# Altium schematic sheet AWSAM_5_MPU_3V.SchDoc
size A4; Engineer: Akshat
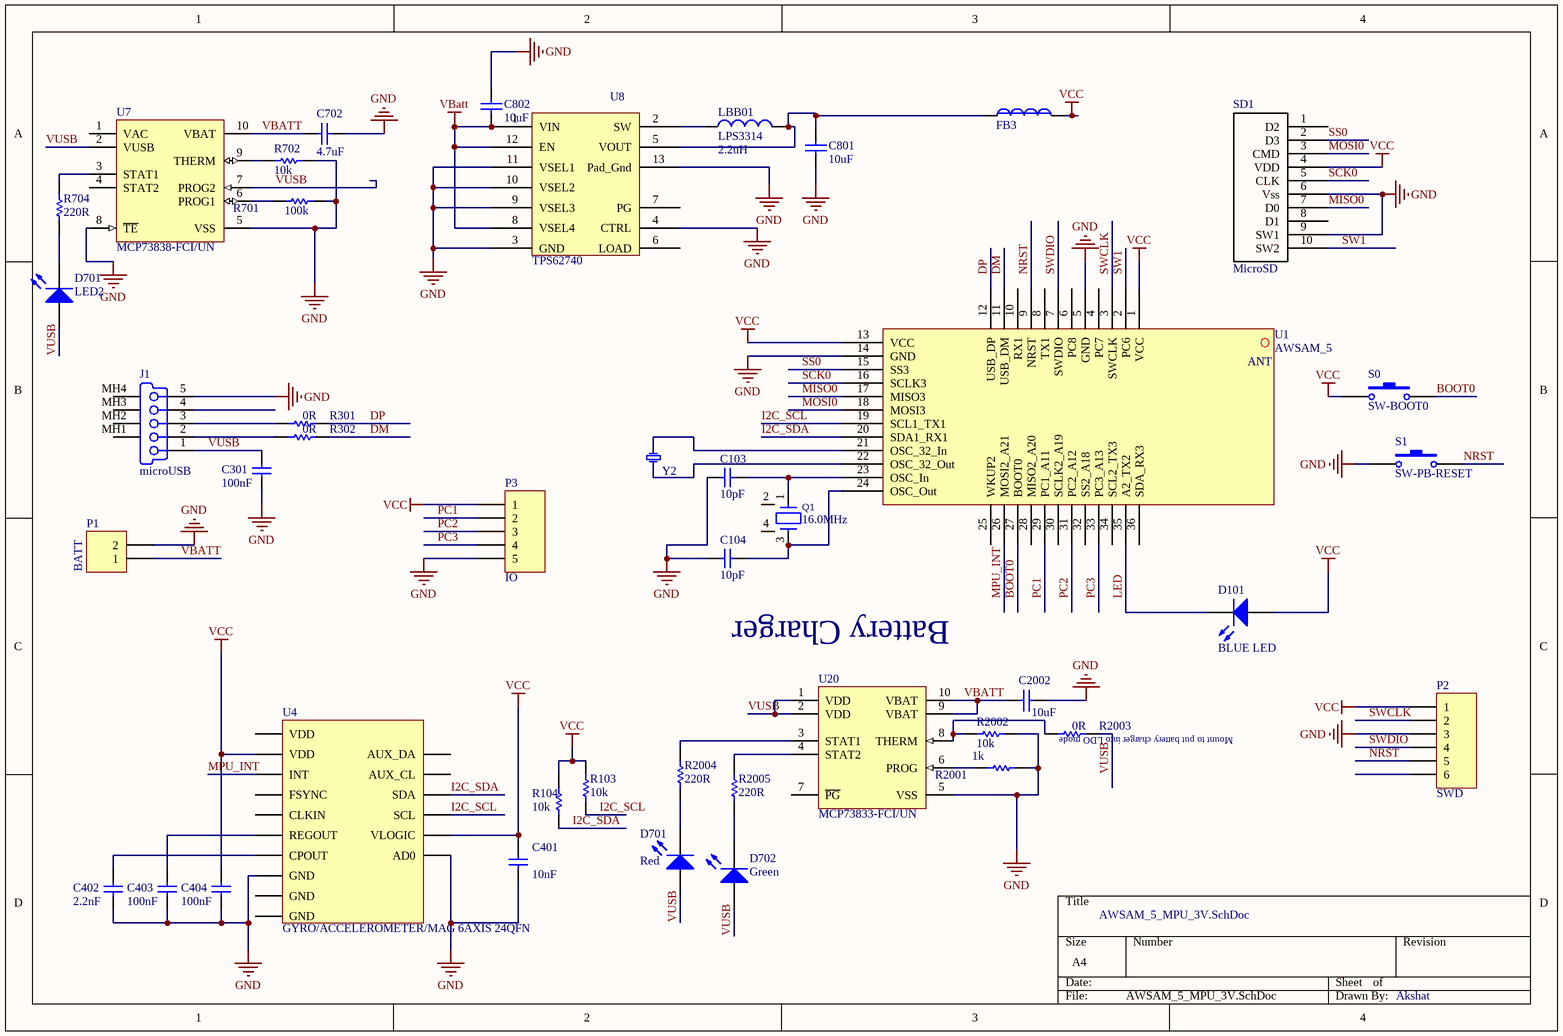
[diagram p0: AWSAM_5_MPU_3V.SchDoc]

## Parts
(Parts that share a designator on the sheet are numbered #1, #2 ... from top to bottom, then left to right.)
C103  10pF  [CAPC1005L]
C104  10pF  [CAPC1005L]
C301  100nF  [CAP0402]
C401  10nF  [CAP0402]
C402  2.2nF  [CAP0603]
C403  100nF  [CAP0402]
C404  100nF  [CAP0402]
C702  4.7uF  [CAP0603]
C801  10uF  [CAP0603]
C802  10uF  [CAP0603]
C2002  10uF  [CAPC1608L]
D101  BLUE LED  [CAPC1608L]
D701#1  LED2  [CAPC1608M]
D701#2  Red  [CAPC1608L]
D702  Green  [CAPC1608L]
FB3  BLM15AX102SN1D  [IND0402]  (value not drawn)
J1  microUSB  [micro USB]
LBB01  LPS3314  value 2.2uH  [CoilCraft- LPS3314]
P1  BATT  [HDR1X2]
P2  SWD  [HDR1X6]
P3  IO  [HDR1X5]
Q1  value 16.0MHz  [AP7-00061]  (hidden comment: TSX-3225)
R103  10k  [RES0402]
R104  10k  [RES0402]
R301  0R  [RES0402]
R302  0R  [RES0402]
R701  100k  [RES0402]
R702  10K  [RES0402]
R704  220R  [RES0402]
R2001  1k  [RESC1005L]
R2002  10K  [RESC1005L]
R2003  0R  [RESC1005L]
R2004  220R  [RESC1005L]
R2005  220R  [RESC1005L]
S0  SW-BOOT0  [MC32882 Switch]
S1  SW-PB-RESET  [MC32882 Switch]
SD1  MicroSD  [micro SD]
U1  AWSAM_5  [AWSAM_5]
U4  GYRO/ACCELEROMETER/MAG 6AXIS 24QFN  [QFN24]
U7  MCP73838-FCI/UN  [MSOP-UN10_N]
U8  TPS62740  [TPS62740_12Pin]
U20  MCP73833-FCI/UN  [MSOP-UN10_N]
Y2  CM315-32.768KEZF-UT  [SMD Crystal 32kHz]  (value not drawn)

## Nets
GND: C103.1 C104.2 C301.1 C401.1 C402.1 C403.1 C404.1 C702.1 C801.1 C802.2 C2002.1 J1.5(GND) P1.2 P2.3 P3.5 R701.2 R702.2 R2001.2 R2002.2 S1.1 SD1.6(Vss) SD1.9(SW1) U1.5(GND) U1.14(GND) U4.9(AD0) U4.18(GND) U7.5(VSS) U7.8(~{TE}) U8.3(GND) U8.4(CTRL) U8.9(VSEL3) U8.10(VSEL2) U8.11(VSEL1) U8.13(Pad_Gnd) U20.5(VSS)
VBATT: C702.2 C802.1 C2002.2 P1.1 U7.10(VBAT) U8.1(VIN) U8.8(VSEL4) U8.12(EN) U20.9(VBAT) U20.10(VBAT)
VCC: C401.2 C404.2 D101.1(A) FB3.2 P2.1 P3.1 R103.1 R104.1 S0.1 SD1.4(VDD) U1.1(VCC) U1.13(VCC) U4.8(VLOGIC) U4.13(VDD)
BOOT0: S0.2 U1.27(BOOT0)
DM: R302.2 U1.11(USB_DM)
DP: R301.2 U1.12(USB_DP)
I2C_SCL: R103.2 U1.19(SCL1_TX1) U4.23(SCL)
I2C_SDA: R104.2 U1.20(SDA1_RX1) U4.24(SDA)
LED: D101.2(K) U1.35(A2_TX2)
MISO0: SD1.7(D0) U1.17(MISO3)
MOSI0: SD1.3(CMD) U1.18(MOSI3)
MPU_INT: U1.26(MOSI2_A21) U4.12(INT)
NRST: P2.5 S1.2 U1.9(NRST)
PC1: P3.2 U1.29(PC1_A11)
PC2: P3.3 U1.31(PC2_A12)
PC3: P3.4 U1.33(PC3_A13)
SCK0: SD1.5(CLK) U1.16(SCLK3)
SS0: SD1.2(D3) U1.15(SS3)
SW1: SD1.10(SW2) U1.2(PC6)
SWCLK: P2.2 U1.3(SWCLK)
SWDIO: P2.4 U1.7(SWDIO)
VUSB: C301.2 D701#1.1(A) D701#2.1(A) D702.1(A) J1.1(V_BUS_(5V)) R2003.2 U7.2(VUSB) U7.7(PROG2) U20.1(VDD) U20.2(VDD)
NetC103_2: C103.2 Q1.1(IN) U1.23(OSC_In)
NetC104_1: C104.1 Q1.3(OUT) U1.24(OSC_Out)
NetC402_2: C402.2 U4.20(CPOUT)
NetC403_2: C403.2 U4.10(REGOUT)
NetC801_2: C801.2 FB3.1 LBB01.2 U8.5(VOUT)
NetD701#1_2: D701#1.2(K) R704.1
NetD701#2_2: D701#2.2(K) R2004.1
NetD702_2: D702.2(K) R2005.1
NetJ1_2: J1.2(D-) R302.1
NetJ1_3: J1.3(D+) R301.1
NetLBB01_1: LBB01.1 U8.2(SW)
NetR701_1: R701.1 U7.6(PROG1)
NetR702_1: R702.1 U7.9(THERM)
NetR704_2: R704.2 U7.3(STAT1)
NetR2001_1: R2001.1 U20.6(PROG)
NetR2002_1: R2002.1 R2003.1 U20.8(THERM)
NetR2004_2: R2004.2 U20.3(STAT1)
NetR2005_2: R2005.2 U20.4(STAT2)
NetU1_21: U1.21(OSC_32_In) Y2.2
NetU1_22: U1.22(OSC_32_Out) Y2.1

Not connected (* = marked no-connect by the designer): J1 4(NC) MH1(Tab) MH2(Tab) MH3(Tab) MH4(Tab); P2 6; Q1 2(GND) 4(GND); SD1 1(D2) 8(D1); U1 4(PC7) 6(PC8) 8(TX1) 10(RX1) 25(WKUP2) 28(MISO2_A20) 30(SCLK2_A19) 32(SS2_A18) 34(SCL2_TX3) 36(SDA_RX3); U4 1(CLKIN) 3(VDD) 6(AUX_DA) 7(AUX_CL) 11(FSYNC) 15(GND) 17(GND); U7 1(VAC) 4(STAT2); U8 6(LOAD) 7(PG); U20 7(~{PG})

## Notes on the sheet
- Battery Charger
- (near R2003) Mount to put battery charger into LDO mode
- (in symbol AWSAM_5) ANT

## Library data of the parts
C103 C104 C402 = C1608X7R1H222K: CAP CER 2200PF 50V 10% X7R 0603; Manufacturer: TDK Corporation; Manufacturer Part Number: C1608X7R1H222K; Voltage - Rated: 50V; Tolerance: ±10%; Temperature Coefficient: X7R; Package / Case: 0603 (1608 Metric); ComponentLink1URL: http://www.tdk.com/pdf/general_B11.pdf; ComponentLink1Description: http://www.tdk.com/pdf/general_B11.pdf; Supplier: Digi-Key
  C103 C104: Supplier Part Number: 445-1309-1-ND; Capacitance: 10pF; SLink: http://www.digikey.com/product-detail/en/500R07S100GV4T/712-1252-6-ND/1786924; Digikey: 712-1252-6-ND
  C402: Digikey: 490-1459-1-ND; Capacitance: 2.2nF; SLink: http://www.digikey.com/product-detail/en/GRM1885C1H222JA01D/490-1459-1-ND/587663
C301 C403 C404 = C1005X7R1C104K: CAP CER 0.1UF 16V 10% X7R 0402; Manufacturer: TDK Corporation; Manufacturer Part Number: C1005X7R1C104K; Voltage - Rated: 16V; Tolerance: ±10%; Temperature Coefficient: X7R; Package / Case: 0402 (1005 Metric); Thickness (Max): 0.022" (0.55mm); ComponentLink1URL: http://www.tdk.com/pdf/general_B11.pdf; ComponentLink1Description: http://www.tdk.com/pdf/general_B11.pdf; Supplier: Digi-Key; Digikey: 445-4952-1-ND; Capacitance: 100nF; SLink: http://www.digikey.com/product-detail/en/C1005X7R1C104K050BC/445-4952-1-ND/2093566
C401 = C1005X7R1E103K050BB: CAP CER 10000PF 25V 10% X7R 0402; Manufacturer: TDK Corporation; Manufacturer Part Number: C1005X7R1E103K050BB; Voltage - Rated: 25V; Tolerance: ±10%; Temperature Coefficient: X7R; Package / Case: 0402 (1005 Metric); ComponentLink1URL: http://www.tdk.com/pdf/general_B11.pdf; ComponentLink1Description: http://www.tdk.com/pdf/general_B11.pdf; Digikey: 445-1260-1-ND; Supplier: Digi-Key; Capacitance: 10nF; SLink: http://www.digikey.com/product-detail/en/C1005X7R1E103K050BB/445-1260-1-ND/567737
C702 C801 C802 = C1608X5R1A106K: CAP CER 10UF 10V 10% X5R 0603; Manufacturer: TDK Corporation; Manufacturer Part Number: C1608X5R1A106K; Voltage - Rated: 10V; Tolerance: ±10%; Temperature Coefficient: X5R; Package / Case: 0603 (1608 Metric); ComponentLink1URL: http://www.tdk.com/pdf/general_B11.pdf; ComponentLink1Description: http://www.tdk.com/pdf/general_B11.pdf; Supplier: Digi-Key
  C702: Supplier Part Number: 511-1496-2-ND; Capacitance: 4.7uF; SLink: http://www.digikey.co.nz/product-detail/en/TCM1A475M8R/511-1496-1-ND/1209673
  C801 C802: Supplier Part Number: 445-7486-1-ND; Capacitance: 10uF; SLink: http://www.digikey.com/product-detail/en/C1608X5R1A106K080AC/445-7486-1-ND/2733558
C2002 = C1608X5R1A106K: Manufacturer: TDK Corporation; Voltage - Rated: 10V; Tolerance: ±10%; Temperature Coefficient: X5R; Capacitance: 4.7uF; Manufacturer Part Number: C1608X5R1A106K; Package / Case: 0603 (1608 Metric); ComponentLink1URL: http://www.tdk.com/pdf/general_B11.pdf; ComponentLink1Description: http://www.tdk.com/pdf/general_B11.pdf; Supplier: Digi-Key; Supplier Part Number: 511-1496-2-ND; SLink: http://www.digikey.co.nz/product-detail/en/TCM1A475M8R/511-1496-1-ND/1209673
D101 D701#1 D701#2 D702 = LED2: Typical RED, GREEN, YELLOW, AMBER GaAs LED; Published: 8-Jun-2000; LatestRevisionDate: 17-Jul-2002; LatestRevisionNote: Re-released for DXP Platform.; PackageVersion: Feb-2002; PackageReference: 3.2X1.6X1.1; Publisher: Altium Limited
FB3 = BLM15AX102SN1D: FERRITE CHIP 1000 OHM 0402; Manufacturer: Murata Electronics North America; Impedance @ Frequency: 1 kOhm @ 100MHz; Current Rating: 350mA; DC Resistance (DCR): 490 mOhm Max; Manufacturer Part Number: BLM15AX102SN1D; Package / Case: 0402 (1005 Metric); ComponentLink1URL: http://search.murata.co.jp/Ceramy/image/img/PDF/ENG/L0110S0100BLM15AX_SN.pdf; ComponentLink1Description: http://search.murata.co.jp/Ceramy/image/img/PDF/ENG/L0110S0100BLM15AX_SN.pdf; Supplier: Digi-Key; Supplier Part Number: 490-5442-1-ND; SLink: http://www.digikey.com/product-detail/en/BLM15AX102SN1D/490-5442-1-ND/2256886
J1 = 0481900001: USB On-The-Go (OTG) Mini-B Receptacle, Right Angle, SMT, 0.80mm (.031") Pitch, Solder Tabs with Back Cover, Recessed Type; PCB_Layout: Complies with Manufacturer's Recommendation.; Published: 21-Sep-2007; DatasheetVersion: revA, May-2004; PackageVersion: May-2004; PackageReference: 481900001; Publisher: Altium Limited; PackageDescription: USB Mini-B, Sinking Type, SM; 5 Position; Right Angle, Body 11.45 x 11.8 x 3.9 mm (LxWxH); ComponentLink1Description: Manufacturer Link; ComponentLink1URL: http://www.molex.com/; ComponentLink2Description: Datasheet; ComponentLink2URL: http://www.molex.com/cmc_upload/0/000/895/958/SD-48190-001RevA.pdf; SLink: http://nz.element14.com/molex/47346-0001/connector-micro-usb-b-rcpt-5pos/dp/2119232?MER=MER-BPR-4PPM-PD-MOLX-CNN&; Element14: 2119232
LBB01 = Inductor: Code_IEC: 1005; Published: 8-Jun-2000; LatestRevisionDate: 29-May-2009; LatestRevisionNote: IPC-7351 Footprint Added.; PackageReference: 0402-A; Publisher: Altium Limited; PackageDescription: Chip Inductor; Code_JEITA: 0402; Mouser: 994-LPS3314-222MRB; SLink: http://nz.mouser.com/ProductDetail/Coilcraft/LPS3314-222MRB/?qs=%2fha2pyFaduh2AdVM2MOyaO78%2fz9pqEgQ6FaCzET4PqZ7pHcWvXsWv0DS1bzafKVX
P1 = Header 2H: Header, 2-Pin, Right Angle; LatestRevisionDate: 17-Jul-2002; LatestRevisionNote: Re-released for DXP Platform.; Publisher: Altium Limited
P2 = Header 6: Header, 6-Pin; LatestRevisionDate: 17-Jul-2002; LatestRevisionNote: Re-released for DXP Platform.; Publisher: Altium Limited
P3 = Header 5: Header, 5-Pin; LatestRevisionDate: 17-Jul-2002; LatestRevisionNote: Re-released for DXP Platform.; Publisher: Altium Limited
Q1 = A07-0078: 16MHz uXtal, 3.2 x 2.5 mm SMD, CL=9pF, 15PPM, ESR=80ohm(Max.; PartGroup: Frequency devices,Crystals,SMD; Manufacturer: Epson Toyocom; MPN: TSX-3225 16.0000MF09Z-AC3; TemperatureRange: -20 deg C to 70 deg C; ComponentStatus: 'Active (verified)'; Dig: SER3628CT-ND; AN: A07-0078; Tolerance: 15ppm; Height: 0.699999988079071; FootprintStatus: 'New (Not verified)'; Element14: 1712841; SLink: http://nz.element14.com/epson/x1e0000210013/crystal-tsx-3225-16-mhz-9-pf/dp/1712841
R103 R104 R301 R302 = CRCW040210K0FKED: RES 10.0K OHM 1/16W 1% 0402 SMD; Manufacturer: Vishay Dale; Power (Watts): 0.063W, 1/16W; Temperature Coefficient: ±100ppm/°C; Manufacturer Part Number: CRCW040210K0FKED; Tolerance: ±1%; Package / Case: 0402 (1005 Metric); Height: 0.016" (0.40mm); ComponentLink1URL: http://www.vishay.com/doc?20035; ComponentLink1Description: http://www.vishay.com/doc?20035; Supplier: Digi-Key; Supplier Part Number: 541-10.0KLCT-ND
  R103 R104: Resistance (Ohms): 10k; SLink: http://www.digikey.com/product-detail/en/MCR01MRTF1002/RHM10.0KCDCT-ND/2796414; Digikey: RHM10.0KCDCT-ND
  R301 R302: Resistance (Ohms): 0R; SLink: http://www.digikey.com/product-detail/en/ERJ-2GE0R00X/P0.0JCT-ND/146726; Digikey: P0.0JCT-ND
R701 R702 R704 R2002 R2004 R2005 = CRCW0402100KFKED: RES 100K OHM 1/16W 1% 0402 SMD; Manufacturer: Vishay Dale; Power (Watts): 0.063W, 1/16W; Temperature Coefficient: ±100ppm/°C; Manufacturer Part Number: CRCW0402100KFKED; Tolerance: ±1%; Package / Case: 0402 (1005 Metric); ComponentLink1URL: http://www.vishay.com/doc?20035; ComponentLink1Description: http://www.vishay.com/doc?20035; Supplier: Digi-Key
  R701 R704 R2004 R2005: Supplier Part Number: 541-100KLCT-ND; Resistance (Ohms): 100k; SLink: http://www.digikey.com/product-detail/en/CRCW0402100KFKED/541-100KLCT-ND/1183351
  R702 R2002: Supplier Part Number: 541-10.0KLCT-ND; Resistance (Ohms): 10k; SLink: http://www.digikey.co.nz/product-detail/en/CRCW040210K0FKED/541-10.0KLCT-ND/1183237
R2001 = CRCW0402100KFKED: Manufacturer: Vishay Dale; Power (Watts): 0.063W, 1/16W; Temperature Coefficient: ±100ppm/°C; Tolerance: ±1%; Resistance (Ohms): 100k; Manufacturer Part Number: CRCW0402100KFKED; Package / Case: 0402 (1005 Metric); ComponentLink1URL: http://www.vishay.com/doc?20035; ComponentLink1Description: http://www.vishay.com/doc?20035; Supplier: Digi-Key; Supplier Part Number: 541-100KLCT-ND; SLink: http://www.digikey.com/product-detail/en/CRCW0402100KFKED/541-100KLCT-ND/1183351
R2003 = CRCW040210K0FKED: Manufacturer: Vishay Dale; Power (Watts): 0.063W, 1/16W; Temperature Coefficient: ±100ppm/°C; Tolerance: ±1%; Manufacturer Part Number: CRCW040210K0FKED; Package / Case: 0402 (1005 Metric); Height: 0.016" (0.40mm); ComponentLink1URL: http://www.vishay.com/doc?20035; ComponentLink1Description: http://www.vishay.com/doc?20035; Supplier: Digi-Key; Supplier Part Number: 541-10.0KLCT-ND; Resistance (Ohms): 0R; SLink: http://www.digikey.com/product-detail/en/ERJ-2GE0R00X/P0.0JCT-ND/146726; Digikey: P0.0JCT-ND
S0 S1 = SW-PB: Switch; Published: 24-Mar-1999; LatestRevisionDate: 17-Jul-2002; LatestRevisionNote: Re-released for DXP Platform.; PackageReference: SPST-2; Publisher: Altium Limited; PackageDescription: Switch; 2 Leads; SLink: http://nz.element14.com/multicomp/mc32882/switch-tactile-50ma-12vdc-smd/dp/2396053; Element14: 2396053
U4 = MPU-9150: Manufacturer: InvenSense; Bus Protocol: I2C; ComponentLink1URL: http://www.invensense.com/mems/gyro/documents/PS-MPU-6000A-00v3.4.pdf; ComponentLink1Description: http://www.invensense.com/mems/gyro/documents/PS-MPU-6000A-00v3.4.pdf; Supplier: Digikey; Digikey: 1428-1007-1-ND; Manufacturer Part No.: MPU-9150; SLink: http://www.digikey.com/product-detail/en/MPU-6050/1428-1007-1-ND/4038010
U7 = MCP73838-FCI/UN: Stand-Alone Li-Ion/Li-Polymer Battery Charge Management Controller with Autonomous AC-Adapter or USB-Port Source Selection, 4.2V, 10-Pin MSOP, Industrial Temperature; Published: 29-Jan-2009; DatasheetVersion: revA, Nov-2007; PackageVersion: revBB, Aug-2009; PackageReference: MSOP-UN10; Publisher: Altium Limited; PackageDescription: 10-Lead Plastic Micro Small Outline Package (UN) [MSOP]; Supplier: Mouser; Mouser: 579-MCP73838-FCI/UN; ComponentLink1Description: Datasheet; ComponentLink1URL: http://ww1.microchip.com/downloads/en/DeviceDoc/22071a.pdf; ComponentLink2Description: Packaging Specification; ComponentLink2URL: http://www.microchip.com/stellent/groups/techpub_sg/documents/packagingspec/en012702.pdf; ComponentLink3Description: Microchip.com Home; ComponentLink3URL: http://www.microchip.com/; SLink: http://nz.mouser.com/ProductDetail/Microchip-Technology/MCP73838-FCI-UN/?qs=sGAEpiMZZMsfD%252bbMpEGFJU1mdYbvapW5fTpOkSwVEWE%3d
U20 = MCP73833-FCI/UN: Stand-Alone Linear Li-Ion/Li-Polymer Charge Management Controller with Power-Good Output, 4.2V, 10-Pin MSOP, Industrial Temperature; Published: 29-Jan-2009; LatestRevisionDate: 27-Nov-2009; LatestRevisionNote: Updated to datasheet revision B, May-2009; DatasheetVersion: revB, May-2009; PackageVersion: revBB, Aug-2009; PackageReference: MSOP-UN10; Publisher: Altium Limited; PackageDescription: 10-Lead Plastic Micro Small Outline Package (UN) [MSOP]; Supplier 1: Digi-Key; Supplier Part Number 1: MCP73833-FCI/UN-ND; Supplier 2: Farnell; Supplier Part Number 2: 1605576; ComponentLink1Description: Datasheet; ComponentLink1URL: http://ww1.microchip.com/downloads/en/DeviceDoc/22005b.pdf; ComponentLink2Description: Packaging Specification; ComponentLink2URL: http://www.microchip.com/stellent/groups/techpub_sg/documents/packagingspec/en012702.pdf; ComponentLink3Description: Microchip.com Home; ComponentLink3URL: http://www.microchip.com/
Y2 = CM315-32.768KEZF-UT: CRYSTAL 32.768KHZ 12.5PF SMD; Manufacturer: Citizen Finetech Miyota; Frequency Tolerance: ±10ppm; ESR (Equivalent Series Resistance): 70 kOhm; Manufacturer Part Number: CM315-32.768KEZF-UT; Frequency: 32.768kHz; Load Capacitance: 12.5pF; Package / Case: 2-SMD; Size / Dimension: 0.126" L x 0.059" W (3.20mm x 1.50mm); Height: 0.035" (0.90mm); ComponentLink1URL: http://cfm.citizen.co.jp/english/product/pdf/CM315.pdf; ComponentLink1Description: http://cfm.citizen.co.jp/english/product/pdf/CM315.pdf; Supplier: Digi-Key; Supplier Part Number: XC1617CT-ND; SLink: http://www.digikey.com/product-detail/en/ECS-.327-12.5-34B/XC1617CT-ND/1693786
U8 = TPS62740: Supplier Part Number: 296-37134-1-ND; SLink: http://www.digikey.co.nz/product-detail/en/TPS62740DSST/296-37134-1-ND/4503015